# EAGLE design Maduino Zero Lorawan Node v2.0 (EAGLE 6.1)
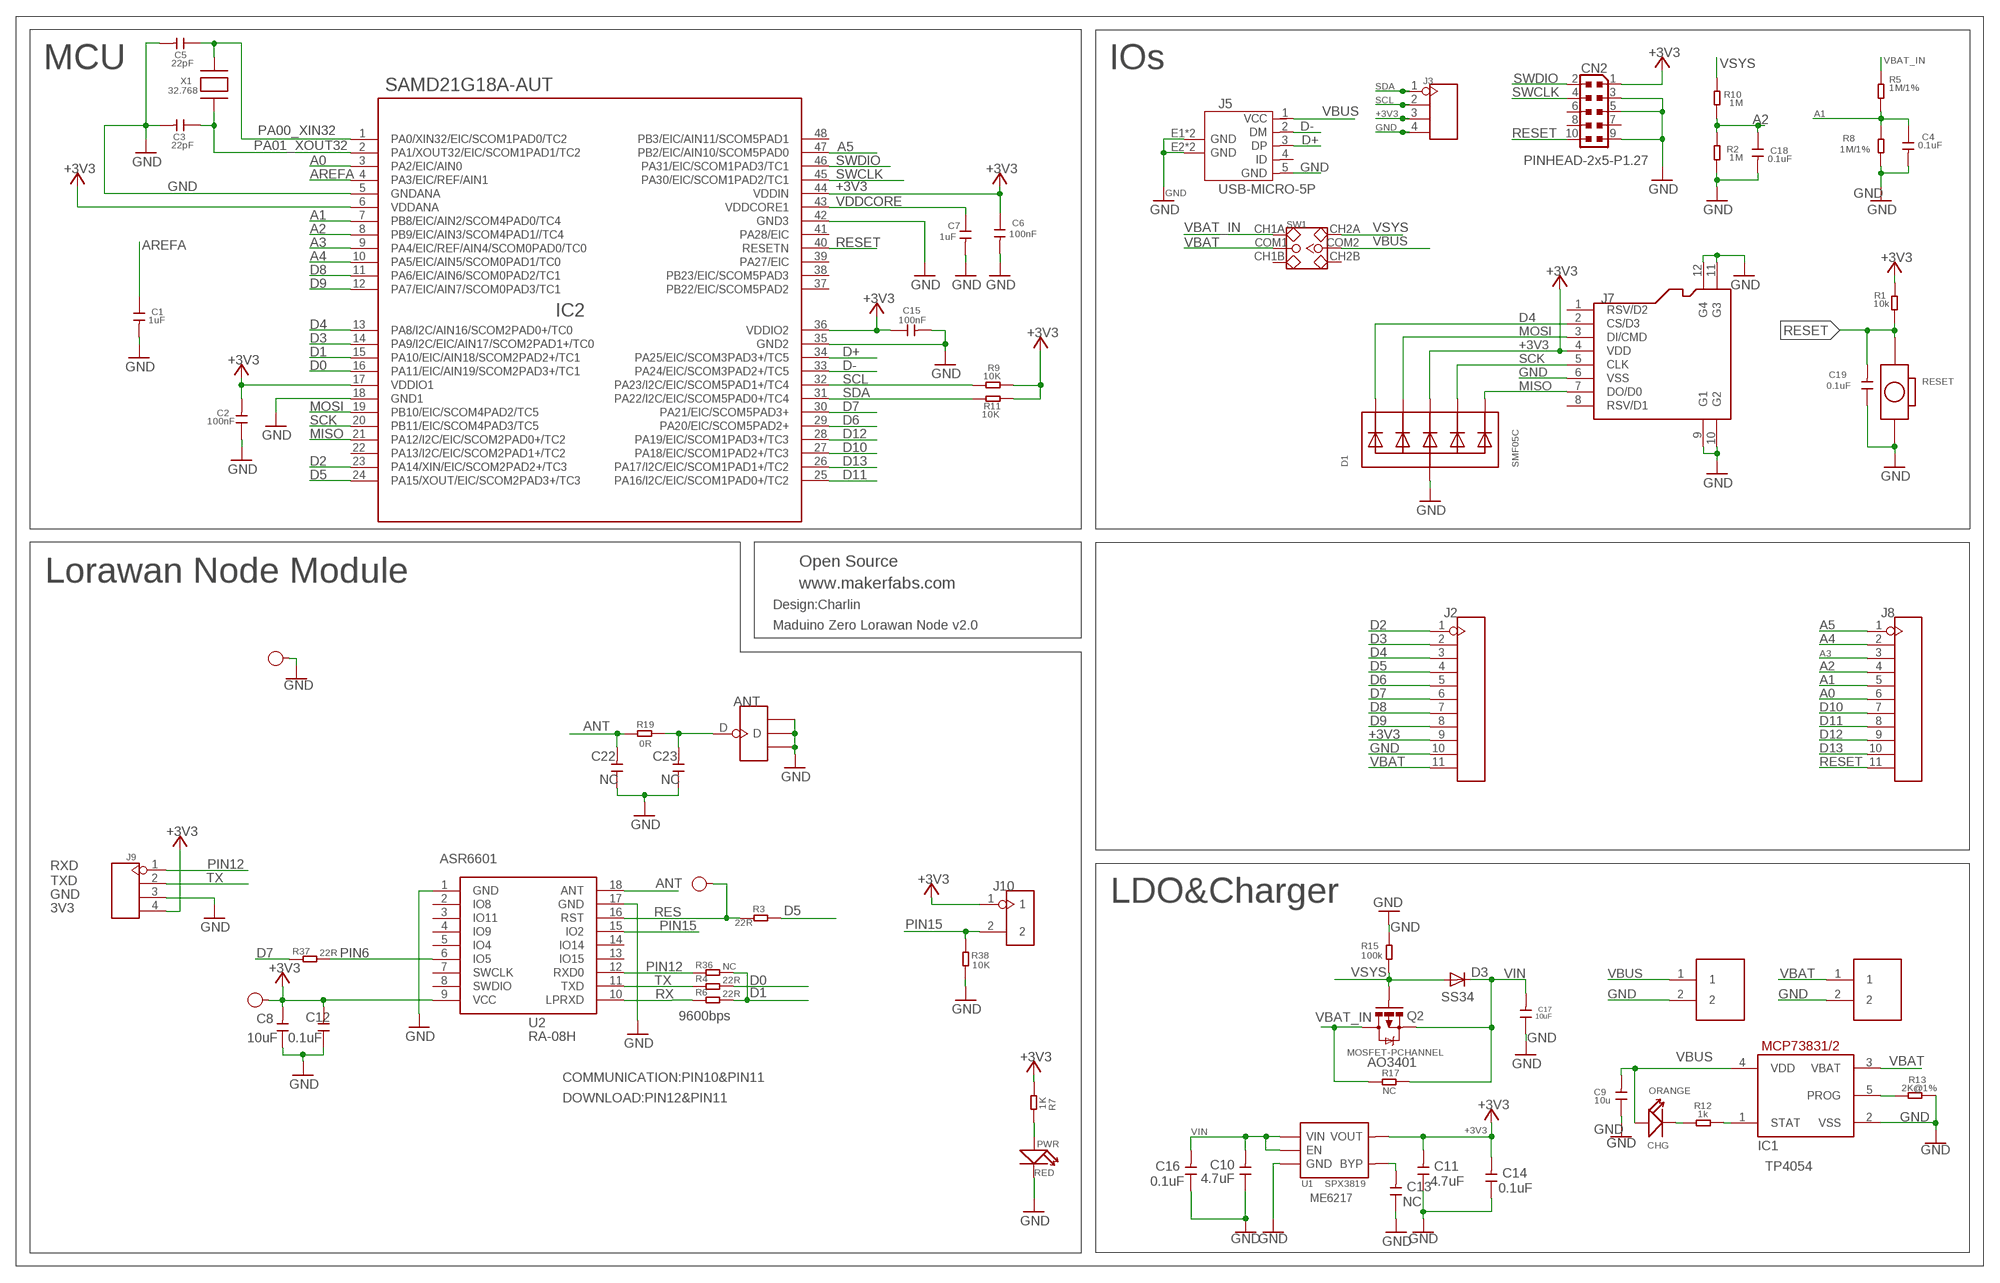
[diagram p0: schematic, sheet 1]

## Parts
3V3  TEST-POINT'4545'  [TP-D45MIL]
ANT  ANTENNA-U-FL  [4P-U-FL]
C1  1uF  C-0603  [0603]
C2  100nF  C-0603  [0603]
C3  22pF  C-0603  [0603]
C4  0.1uF  C-0603  [0603]
C5  22pF  C-0603  [0603]
C6  100nF  C-0603  [0603]
C7  1uF  C-0603  [0603]
C8  10uF  C-0603  [0603]
C9  10u  C-0603  [0603]
C10  4.7uF  C-0603  [0603]
C11  4.7uF  C-0603  [0603]
C12  0.1uF  C-0603  [0603]
C13  NC  C-0603  [0603]
C14  0.1uF  C-0603  [0603]
C15  100nF  C-0603  [0603]
C16  0.1uF  C-0603  [0603]
C17  10uF  C-0603  [0603]
C18  0.1uF  C-0603  [0603]
C19  0.1uF  C-0603  [0603]
C22  NC  C-0603  [0603]
C23  NC  C-0603  [0603]
CHG  ORANGE  007-LED0603  [D0603]
CN2  PINHEAD-2x5-P1.27  0171_PH127-205DF055G00AROUND-PADS  [PINHEAD_2X05_127]
D1  SMF05C  TVSARRAY_5LANE  [SOT363]
D3  SS34  DIODE-DO-214AC  [DO-214AC]
GND  TEST-POINT'4545'  [TP-D45MIL]
IC1  MCP73831/OT  [SOT23-5L]
IC2  SAMD21G18A-AUT  ATSAMD21G18A-AUT  [TQFP48-7X7]
J1  PH2.0-2P-90-DIP  [PH2.0-2P-90-DIP]
J2  HEADER-11P-2.54  [11P-2.54]
J3  HEADER-4P-60/35MILROUND  [4P-65/35ROUND]
J5  USB-MICRO-5P  [MICRO-USB-5P]
J6  PH2.0-2P-90-DIP  [PH2.0-2P-90-DIP]
J7  HOLDER-MICROSD-8P  [8P-SMD]
J8  HEADER-11P-2.54  [11P-2.54]
J9  HEADER-4P-60/35MILROUND  [4P-65/35ROUND]
J10  HEADER-2P-2.0  [2P-2.0]
PWR  RED  LED'0603'  [LED-0603]
Q2  MOSFET-PCHANNEL  [SOT23-3]
R1  10k  R-0603  [R0603]
R2  1M  R-0603  [R0603]
R3  22R  R-0603  [R0603]
R4  22R  R-0603  [R0603]
R5  1M/1%  R-0603  [R0603]
R6  22R  R-0603  [R0603]
R7  1K  R-0603  [R0603]
R8  1M/1%  R-0603  [R0603]
R9  10K  R-0603  [R0603]
R10  1M  R-0603  [R0603]
R11  10K  R-0603  [R0603]
R12  1k  R-0603  [R0603]
R13  2K@1%  R-0603  [R0603]
R15  100k  R-0603  [R0603]
R17  NC  R-0603  [R0603]
R19  0R  R-0603  [R0603]
R36  NC  R-0603  [R0603]
R37  22R  R-0603  [R0603]
R38  10K  R-0603  [R0603]
RESET  BOTTON-2P-90D  [2P-7.62X3.56-90D]
RST  TEST-POINT'4545'  [TP-D45MIL]
SW1  SWITCH-2CH-6P  [6P-2CH-2.54-7.6X3.0]
U1  SPX3819  [SOT23-5]
U2  RA-08H  [RA-08H]
X1  32.768  XTAL-3.2X1.5  [XTAL3215]

## Nets
+3V3: 3V3.T C2.2 C6.1 C8.2 C11.2 C12.2 C14.2 C15.1 CN2.1 D1.4(C3) IC2.6(VDDANA) IC2.17(VDDIO1) IC2.36(VDDIO2) IC2.44(VDDIN) J2.9 J3.3 J7.4(VDD) J9.4 J10.1 R1.2 R7.1 R9.2 R11.2 U1.5(VOUT) U2.9(VCC)
A0: IC2.3(PA2/EIC/AIN0) J8.6
A1: C4.1 IC2.7(PB8/EIC/AIN2/SCOM4PAD0/TC4) J8.5 R5.1 R8.2
A2: C18.1 IC2.8(PB9/EIC/AIN3/SCOM4PAD1//TC4) J8.4 R2.2 R10.1
A3: IC2.9(PA4/EIC/REF/AIN4/SCOM0PAD0/TC0) J8.3
A4: IC2.10(PA5/EIC/AIN5/SCOM0PAD1/TC0) J8.2
A5: IC2.47(PB2/EIC/AIN10/SCOM5PAD0) J8.1
ANT: C22.2 R19.1 U2.18(ANT)
AREFA: C1.1 IC2.4(PA3/EIC/REF/AIN1)
D0: IC2.16(PA11/EIC/AIN19/SCOM2PAD3+/TC1) R4.2
D1: IC2.15(PA10/EIC/AIN18/SCOM2PAD2+/TC1) R6.2 R36.2
D2: IC2.23(PA14/XIN/EIC/SCOM2PAD2+/TC3) J2.1
D3: IC2.14(PA9/I2C/EIC/AIN17/SCOM2PAD1+/TC0) J2.2
D4: D1.1(C1) IC2.13(PA8/I2C/AIN16/SCOM2PAD0+/TC0) J2.3 J7.2(CS/D3)
D5: IC2.24(PA15/XOUT/EIC/SCOM2PAD3+/TC3) J2.4 R3.2
D6: IC2.29(PA20/EIC/SCOM5PAD2+) J2.5
D7: IC2.30(PA21/EIC/SCOM5PAD3+) J2.6 R37.1
D8: IC2.11(PA6/EIC/AIN6/SCOM0PAD2/TC1) J2.7
D9: IC2.12(PA7/EIC/AIN7/SCOM0PAD3/TC1) J2.8
D10: IC2.27(PA18/EIC/SCOM1PAD2+/TC3) J8.7
D11: IC2.25(PA16/I2C/EIC/SCOM1PAD0+/TC2) J8.8
D12: IC2.28(PA19/EIC/SCOM1PAD3+/TC3) J8.9
D13: IC2.26(PA17/I2C/EIC/SCOM1PAD1+/TC2) J8.10
D+: IC2.34(PA25/EIC/SCOM3PAD3+/TC5) J5.3(DP)
D-: IC2.33(PA24/EIC/SCOM3PAD2+/TC5) J5.2(DM)
GND: ANT.GND1 ANT.GND2 ANT.GND3 C1.2 C2.1 C3.2 C4.2 C5.2 C6.2 C7.2 C8.1 C9.1 C10.1 C11.1 C12.1 C13.1 C14.1 C15.2 C16.1 C17.1 C18.2 C19.1 C22.1 C23.1 CN2.3 CN2.5 CN2.9 D1.2(A) GND.T IC1.2(VSS) IC2.5(GNDANA) IC2.18(GND1) IC2.35(GND2) IC2.42(GND3) J1.2 J2.10 J3.4 J5.5(GND) J5.E1(GND) J5.E2(GND) J5.P1(GND) J5.P2(GND) J6.2 J7.6(VSS) J7.9(G1) J7.10(G2) J7.11(G3) J7.12(G4) J9.3 PWR.- R2.1 R8.1 R13.2 R15.2 R38.2 RESET.P$2 U1.2(GND) U2.1(GND) U2.17(GND)
MISO: D1.6(C5) IC2.21(PA12/I2C/EIC/SCOM2PAD0+/TC2) J7.7(DO/D0)
MOSI: D1.3(C2) IC2.19(PB10/EIC/SCOM4PAD2/TC5) J7.3(DI/CMD)
N$3: PWR.+ R7.2
N$13: ANT.D C23.2 R19.2
N$25: CHG.- R12.1
N$26: IC1.1(STAT) R12.2
N$31: IC1.5(PROG) R13.1
N$76: C13.2 U1.4(BYP)
PA00_XIN32: C5.1 IC2.1(PA0/XIN32/EIC/SCOM1PAD0/TC2) X1.P$2
PA01_XOUT32: C3.1 IC2.2(PA1/XOUT32/EIC/SCOM1PAD1/TC2) X1.P$1
PIN6: R37.2 U2.6(IO5)
PIN12: J9.1 R36.1 U2.12(RXD0)
PIN15: J10.2 R38.1 U2.15(IO2)
RES: R3.1 RST.T U2.16(RST)
RESET: C19.2 CN2.10 IC2.40(RESETN) J8.11 R1.1 RESET.P$1
RX: R6.1 U2.10(LPRXD)
SCK: D1.5(C4) IC2.20(PB11/EIC/SCOM4PAD3/TC5) J7.5(CLK)
SCL: IC2.32(PA23/I2C/EIC/SCOM5PAD1+/TC4) J3.2 R9.1
SDA: IC2.31(PA22/I2C/EIC/SCOM5PAD0+/TC4) J3.1 R11.1
SWCLK: CN2.4 IC2.45(PA30/EIC/SCOM1PAD2/TC1)
SWDIO: CN2.2 IC2.46(PA31/EIC/SCOM1PAD3/TC1)
TX: J9.2 R4.1 U2.11(TXD)
VBAT: IC1.3(VBAT) J2.11 J6.1 SW1.COM1
VBAT_IN: Q2.3(D) R5.2 R17.1 SW1.CH1A
VBUS: C9.2 CHG.+ IC1.4(VDD) J1.1 J5.1(VCC) SW1.COM2
VDDCORE: C7.1 IC2.43(VDDCORE1)
VIN: C10.2 C16.2 C17.2 D3.C Q2.2(S) R17.2 U1.1(VIN) U1.3(EN)
VSYS: D3.A Q2.1(G) R10.2 R15.1 SW1.CH2A
Unconnected: CN2.6 CN2.7 CN2.8 IC2.22(PA13/I2C/EIC/SCOM2PAD1+/TC2) IC2.37(PB22/EIC/SCOM5PAD2) IC2.38(PB23/EIC/SCOM5PAD3) IC2.39(PA27/EIC) IC2.41(PA28/EIC) IC2.48(PB3/EIC/AIN11/SCOM5PAD1) J5.4(ID) J7.1(RSV/D2) J7.8(RSV/D1) SW1.CH1B SW1.CH2B U2.2(IO8) U2.3(IO11) U2.4(IO9) U2.5(IO4) U2.7(SWCLK) U2.8(SWDIO) U2.13(IO15) U2.14(IO14)

## Notes on the sheet
- MCU | IOs
- Open Source
- Lorawan Node Module
- www.makerfabs.com
- Design:Charlin
- Maduino Zero Lorawan Node v2.0
- ASR6601
- RXD
- TXD
- GND
- LDO&Charger
- 3V3
- 9600bps
- AO3401
- COMMUNICATION:PIN10&PIN11
- DOWNLOAD:PIN12&PIN11
- TP4054
- ME6217

## Library data of the parts
3V3 GND RST = Discrete-new:TEST-POINT; PARTNO: DNP
ANT = Connector:ANTENNA-U-FL
C1-C19 C22 C23 = Discrete:C*: Ceramic Capacitors
CHG = Discrete:007-LED*
CN2 = Connettori:0171_PH127-205DF055G00A: 2x5 PASSO 1,27
D1 = microbuilder:TVSARRAY_5LANE: Voltage Transient Suppressor Array SOT363 SMF05C - 100W 5V: Digikey - SMF05CT1GOSCT-ND
D3 = diode:DIODE-: DIODE
IC1 = adafruit:MCP73831: MCP73831/2 Miniature Single-Cell, Fully Integrated Li-Ion, Li-Polymer Charge Management Controllers. Nice and small simple lipoly charge controller, with adjustable current and status output (LED) http://www.ladyada.net/library/pcb/eaglelibrary.html
IC2 = IC:ATSAMD21G18A-AUT: Atmel D21 32bit ARM Cortex-M0 microcontroller - 48 PIN TQFP 256KB flash memory + 32KB SRAM
J1 J6 = Connector:PH2.0-2P-90-DIP
J2 J8 = Connector:HEADER-11P
J3 J9 = Connector:HEADER-4P
J5 = Connector:USB-MICRO-5P
J7 = Connector:HOLDER-MICROSD-8P
J10 = Connector:HEADER-2P
PWR = Discrete:LED*
Q2 = User-Submitted:MOSFET-PCHANNEL: Generic PMOSFET IRLML2244 - TRANS-11153 (SOT-23 -20V -4.3A) (1.Gate 2.Source 3.Drain) FQP27P06 - COM-10349 <http://www.sparkfun.com/products/10349> (TO-220 -60V -27A) (1.Gate 2.Source 3.Drain); PROD_ID: TRANS-08285
R1-R13 R15 R17 R19 R36-R38 = Discrete:R*
RESET = Discrete:BOTTON-2P
SW1 = Discrete:SWITCH-2CH-6P
U1 = IC:SPX3819
U2 = sale:RA-08H
X1 = adafruit2:XTAL: Low cost SMT crystals, no capacitors included http://www.ladyada.net/library/eagle

## Net classes
0 default: width 0.152 mm, drill 0.305 mm, clearance 0.152 mm
2 gnd: width 0.305 mm, drill 0.559 mm, clearance 0.254 mm
3 usbvcc: width 0.508 mm, drill 0.61 mm, clearance 0.254 mm
4 USBpair: width 0.254 mm, drill 0.406 mm, clearance 0.406 mm

## Board
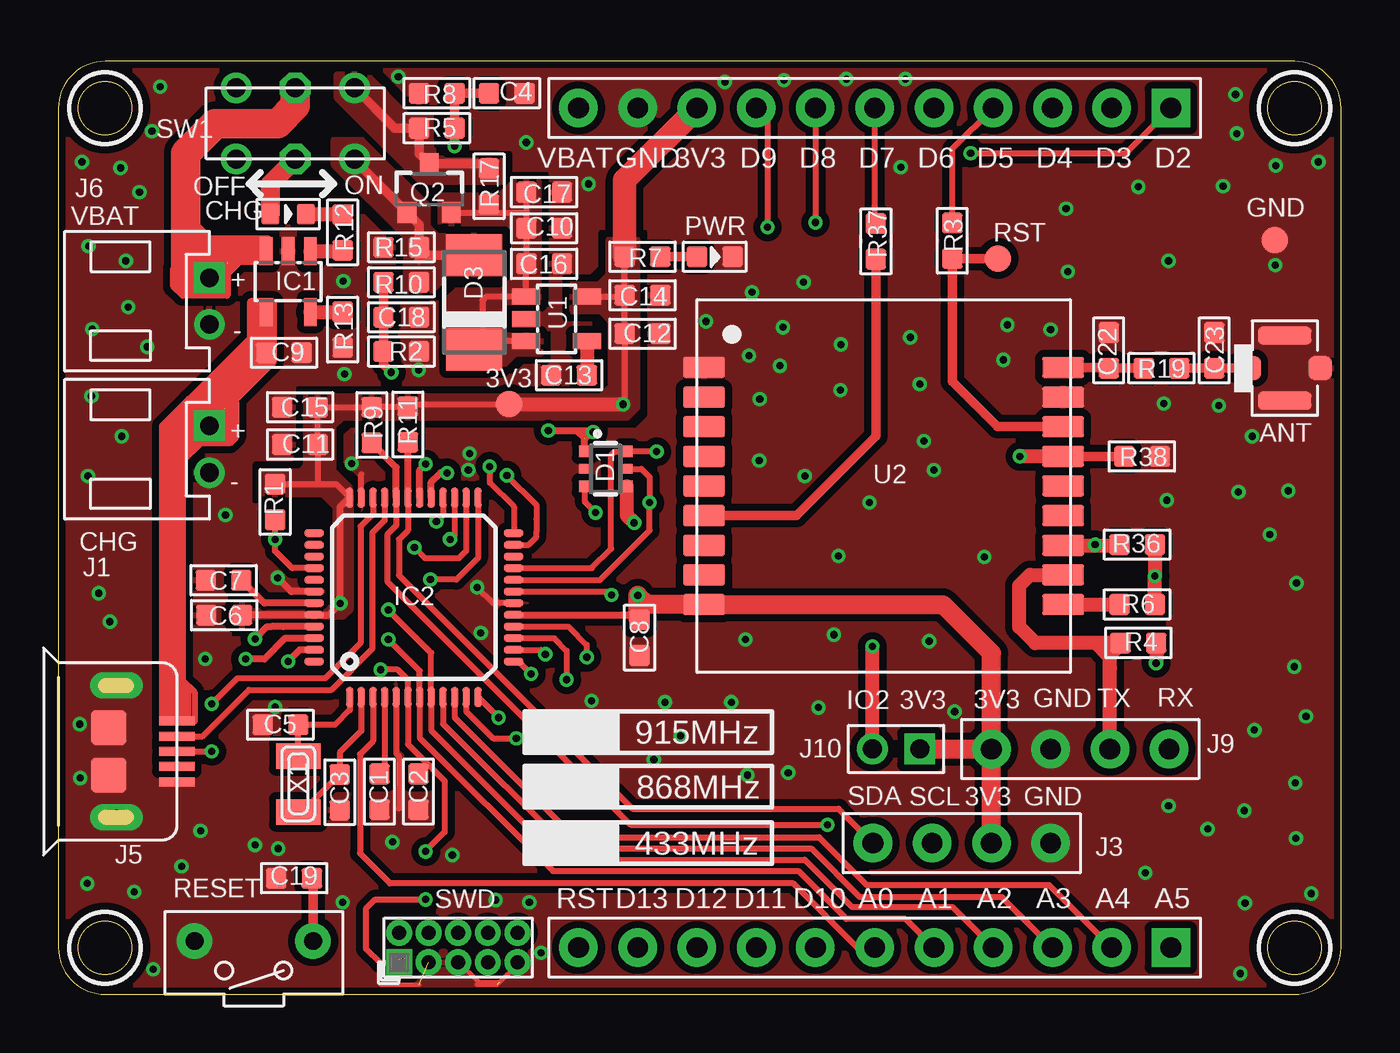
[diagram p1: board, top side]
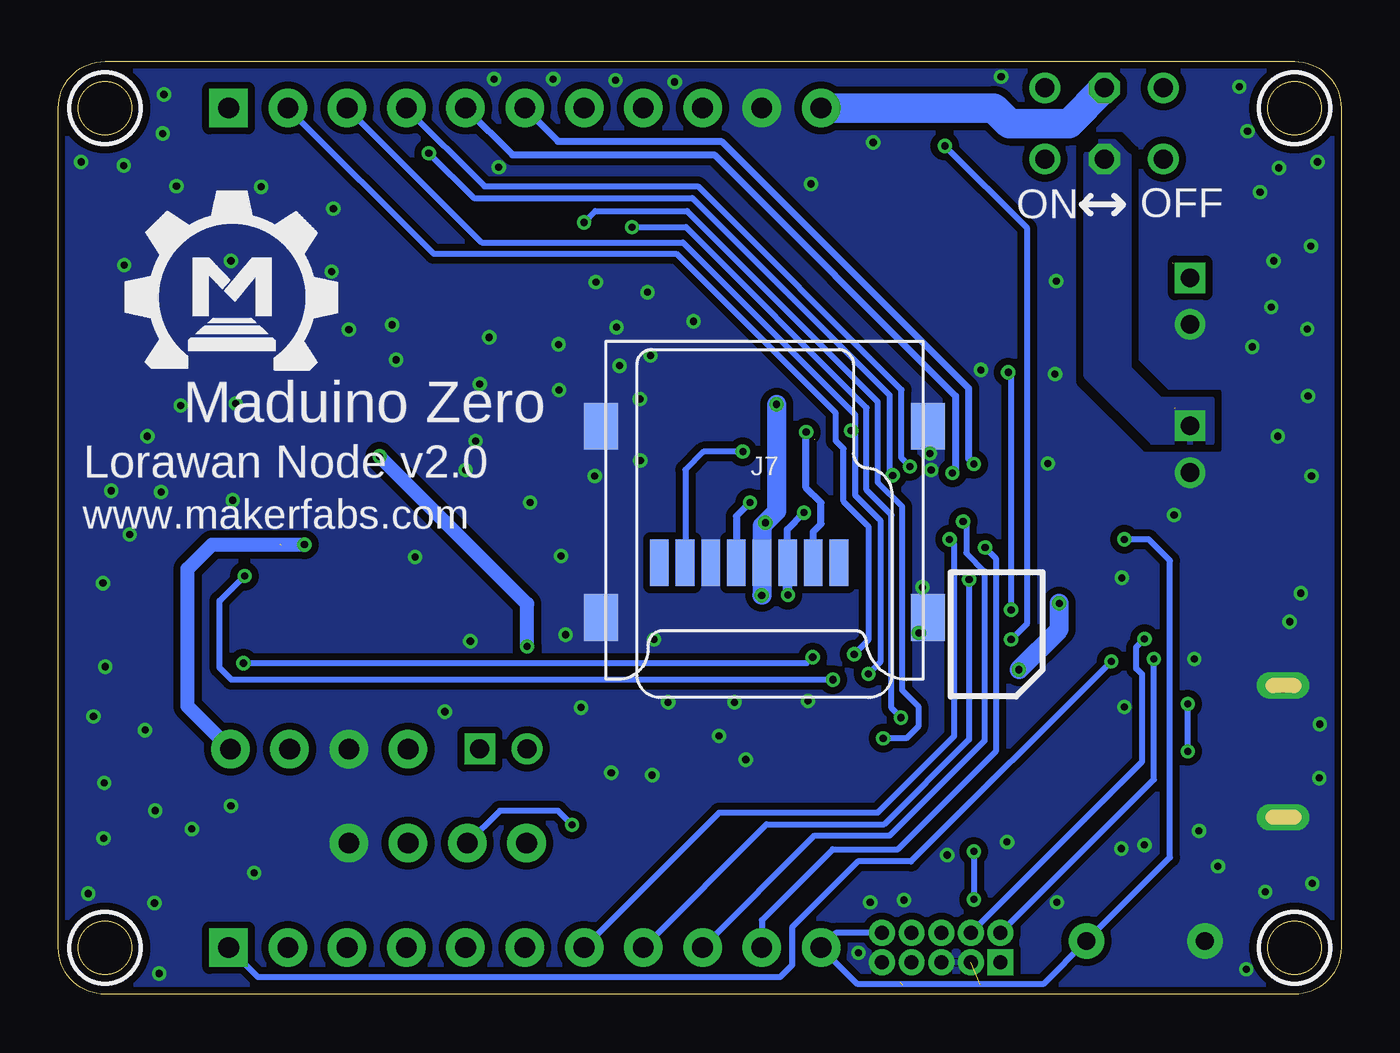
[diagram p2: board, bottom side, seen from below]

Size 55 x 40 mm. Coordinates in mm from the lower left corner, seen from the top.
Outline: 0,38 0,2 arc90 2,0 53,0 arc90 55,2 55,38 arc90 53,40 2,40 arc90 0,38
Outline: circle at 53,2 radius 1.14
Outline: circle at 53,38 radius 1.14
Outline: circle at 2,2 radius 1.14
Outline: circle at 2,38 radius 1.14
Copper layers (1*16): Top 0.035mm / dielectric 1.5mm / Bottom 0.035mm
Design rules: minimum track width 6mil, minimum drill 10mil, track to track 6mil, track to pad 6mil, pad to pad 6mil, via to via 6mil, smd to smd 0mil, copper to edge 10mil, drill to drill 10mil, minimum pad ring 10mil, minimum via ring 6mil, stop-mask expansion 2mil, vias tented up to drill 30mil, thermal gap 0mil
tRestrict: area 51.5,0.5 to 54.5,3.5; area 51.5,36.5 to 54.5,39.5; area 0.5,0.5 to 3.5,3.5; area 0.5,36.5 to 3.5,39.5
bRestrict: area 51.5,0.5 to 54.5,3.5; area 51.5,36.5 to 54.5,39.5; area 0.5,0.5 to 3.5,3.5; area 0.5,36.5 to 3.5,39.5

### Footprints (pad centres in the part's own frame; a part is rotated, then mirrored left to right if it is on the bottom)
TP-D45MIL = smd 1.143 x 1.143: T 0,0
4P-U-FL = smd 1.016 x 1.016: D -1.524,0; GND3 1.524,0 | smd 2.286 x 0.762: GND1 0,1.397; GND2 0,-1.397
0603 = smd 0.889 x 0.889: 1 -0.762,0; 2 0.762,0
D0603 = smd 0.762 x 0.889: + -0.762,0; - 0.762,0
PINHEAD_2X05_127 = drill 0.6 pad 1.016 square: 1 -0.635,2.54 | drill 0.6 pad 1.016: 2 0.635,2.54; 3 -0.635,1.27; 4 0.635,1.27; 5 -0.635,0; 6 0.635,0; 7 -0.635,-1.27; 8 0.635,-1.27; 9 -0.635,-2.54; 10 0.635,-2.54
SOT363 = smd 0.5 x 0.5: 1 -0.75,-0.9; 3 0.75,-0.9; 4 0.75,0.9; 6 -0.75,0.9 | smd 0.4 x 0.5: 2 0,-0.9; 5 0,0.9
DO-214AC = smd 1.8 x 2.4: A 2.025,0; C -2.025,0
SOT23-5L = smd 0.55 x 1.2: 1 -0.95,-1.3; 2 0,-1.3; 3 0.95,-1.3; 4 0.95,1.3; 5 -0.95,1.3
TQFP48-7X7 = smd 0.85 x 0.32: 1 -4.275,2.75; 2 -4.275,2.25; 3 -4.275,1.75; 4 -4.275,1.25; 5 -4.275,0.75; 6 -4.275,0.25; 7 -4.275,-0.25; 8 -4.275,-0.75; 9 -4.275,-1.25; 10 -4.275,-1.75; 11 -4.275,-2.25; 12 -4.275,-2.75; 25 4.275,-2.75; 26 4.275,-2.25; 27 4.275,-1.75; 28 4.275,-1.25; 29 4.275,-0.75; 30 4.275,-0.25; 31 4.275,0.25; 32 4.275,0.75; 33 4.275,1.25; 34 4.275,1.75; 35 4.275,2.25; 36 4.275,2.75 | smd 0.32 x 0.85: 13 -2.75,-4.275; 14 -2.25,-4.275; 15 -1.75,-4.275; 16 -1.25,-4.275; 17 -0.75,-4.275; 18 -0.25,-4.275; 19 0.25,-4.275; 20 0.75,-4.275; 21 1.25,-4.275; 22 1.75,-4.275; 23 2.25,-4.275; 24 2.75,-4.275; 37 2.75,4.275; 38 2.25,4.275; 39 1.75,4.275; 40 1.25,4.275; 41 0.75,4.275; 42 0.25,4.275; 43 -0.25,4.275; 44 -0.75,4.275; 45 -1.25,4.275; 46 -1.75,4.275; 47 -2.25,4.275; 48 -2.75,4.275
PH2.0-2P-90-DIP = drill 0.8 square: 1 0,1 | drill 0.8: 2 0,-1
11P-2.54 = drill 0.889 pad 1.651 square: 1 0,12.7 | drill 0.889 pad 1.651: 2 0,10.16; 3 0,7.62; 4 0,5.08; 5 0,2.54; 6 0,0; 7 0,-2.54; 8 0,-5.08; 9 0,-7.62; 10 0,-10.16; 11 0,-12.7
4P-65/35ROUND = drill 0.889 pad 1.651: 1 0,3.81; 2 0,1.27; 3 0,-1.27; 4 0,-3.81
MICRO-USB-5P = smd 0.38 x 1.52: 1 -1.3,0; 2 -0.65,0; 3 0,0; 4 0.65,0; 5 1.3,0 | smd 1.524 x 1.524: E1 -1.016,-2.921; E2 1.016,-2.921 | drill 0.635 pad 1.143 long: P1 -2.819,-2.591; P2 2.819,-2.591
8P-SMD = smd 0.8 x 2.008: 1 -3.198,0.254; 2 -2.098,0.254; 3 -0.998,0.254; 4 0.102,0.254; 5 1.202,0.254; 6 2.302,0.254; 7 3.402,0.254; 8 4.502,0.254 | smd 1.45 x 2: 9 -7.002,2.6; 10 7.002,2.6; 11 -7.002,-5.598; 12 7.002,-5.598
2P-2.0 = drill 0.813 pad 1.27 square: 1 -1.016,0 | drill 0.813 pad 1.27: 2 1.016,0
LED-0603 = smd 0.889 x 0.889: + -0.762,0; - 0.762,0
SOT23-3 = smd 0.8 x 0.9: 1 -0.95,-1; 2 0.95,-1; 3 0,1.1
R0603 = smd 0.889 x 0.889: 1 -0.762,0; 2 0.762,0
2P-7.62X3.56-90D = drill 0.762 pad 1.524: P$1 0,2.54; P$2 0,-2.54
6P-2CH-2.54-7.6X3.0 = drill 0.813 pad 1.27: CH1A -1.524,2.54; CH1B -1.524,-2.54; CH2A 1.524,2.54; CH2B 1.524,-2.54 | drill 0.813 pad 1.27 octagon: COM1 -1.524,0; COM2 1.524,0
SOT23-5 = smd 0.69 x 1.2: 1 -0.95,-1.3; 2 0,-1.3; 3 0.95,-1.3; 4 0.95,1.3; 5 -0.95,1.3
RA-08H = smd 1.8 x 0.91: 1 -7.7,5.08; 2 -7.7,3.81; 3 -7.7,2.54; 4 -7.7,1.27; 5 -7.7,0; 6 -7.7,-1.27; 7 -7.7,-2.54; 8 -7.7,-3.81; 9 -7.7,-5.08; 10 7.7,-5.08; 11 7.7,-3.81; 12 7.7,-2.54; 13 7.7,-1.27; 14 7.7,0; 15 7.7,1.27; 16 7.7,2.54; 17 7.7,3.81; 18 7.7,5.08
XTAL3215 = smd 1.1 x 1.9: P$1 1.2,0; P$2 -1.2,0

### Placement (x,y rotation side)
3V3  19.33,25.3 0 top
ANT  52.58,26.85 0 top
C1  13.77,8.69 270 top
C2  15.44,8.69 90 top
C3  12.06,8.66 270 top
C4  19.23,38.63 0 top
C5  9.53,11.56 180 top
C6  7.11,16.26 180 top
C7  7.09,17.75 180 top
C8  24.92,15.29 90 top
C9  9.68,27.51 180 top
C10  20.83,32.84 180 top
C11  10.36,23.57 0 top
C12  25.04,28.32 180 top
C13  21.89,26.54 0 top
C14  25.04,29.97 180 top
C15  10.36,25.17 180 top
C16  20.83,31.32 180 top
C17  20.83,34.39 180 top
C18  14.71,29.03 0 top
C19  10.11,4.98 0 top
C22  45.03,27.61 270 top
C23  49.56,27.61 270 top
CHG  9.86,33.45 0 top
CN2  17.14,2 90 top
D1  23.47,22.53 270 top
D3  17.83,29.67 90 top
GND  52.15,32.33 0 top
IC1  9.86,30.56 180 top
IC2  15.24,17.02 90 top
J1  6.48,23.37 0 top
J2  35,38 270 top
J3  38.73,6.48 90 top
J5  5.08,10.41 270 top
J6  6.48,29.72 0 top
J7  24.73,18.76 180 bottom
J8  35,2 270 top
J9  43.81,10.52 270 top
J10  35.92,10.52 180 top
PWR  28.14,31.62 0 top
Q2  15.9,34.52 0 top
R1  9.3,21.11 90 top
R2  14.71,27.56 180 top
R3  38.33,32.31 90 top
R4  46.3,15.06 0 top
R5  16.23,37.13 180 top
R6  46.25,16.71 0 top
R7  25.04,31.62 0 top
R8  16.23,38.63 0 top
R9  13.44,24.41 90 top
R10  14.71,30.53 0 top
R11  14.99,24.43 90 top
R12  12.19,32.66 270 top
R13  12.19,28.5 270 top
R15  14.71,32.03 180 top
R17  18.47,34.65 270 top
R19  47.29,26.85 0 top
R36  46.25,19.28 0 top
R37  35.05,32.28 270 top
R38  46.46,23.06 0 top
RESET  8.38,2.29 270 top
RST  40.28,31.55 180 top
SW1  10.16,37.34 270 top
U1  21.36,28.96 270 top
U2  35.38,21.79 0 top
U$1  [MAKERFABS_0.3]  51.67,26.82 0 bottom
X1  10.29,9.02 270 top

### Tracks (layer width: path | path; a pad name or v marks a point on that pad's centre or on a via)
+3V3  (via drill 0.3)
  Top 0.254: CN2.1 14.59,1.35 13.79,1.35 13.18,1.96 13.18,3.66 13.59,4.06 v15.75,4.06 | v15.75,6.12 15.75,6.15 16.56,6.96 16.56,9.14 15.85,9.86 | v13.82,13.92 14.55,13.92 14.99,13.48 IC2.6 14.99,10.71 15.85,9.86 | C2.2 15.85,9.86 | 3V3.T 15.09,25.3 R11.2 13.46,25.2 R9.2 C15.1 C11.2 11.12,21.89 11.15,21.87 | v24.21,25.3 24.28,25.38 C12.2 C14.2 | C14.2 R7.1 | U1.5 24.22,29.91 C14.2 | R1.2 11.15,21.87 | 11.15,21.87 11.91,21.87 IC2.36
  Top 0.305: IC2.17 24.79,16.27 | C6.1 IC2.44 11.59,16.27 v12.09,16.76 12.09,20.89 IC2.36
  Top 0.61: D1.4 24.37,20.54 v24.69,20.22 | 3V3.T v24.21,25.3
  Top 0.813: J3.3 J9.4 | J9.4 40.01,14.63 37.92,16.71 U2.9 25.23,16.71 v24.84,17.11 24.84,16.22 | J10.1 J9.4 | C8.2 24.84,16.13 24.84,16.22 | 24.84,16.22 24.79,16.27
  Top 1.016: R7.1 24.28,34.9 J2.9
  Bottom 0.254: 24.82,18.52 J7.4 | v15.75,6.12 v15.75,4.06
  Bottom 0.61: 24.82,20.09 v24.69,20.22
  Bottom 0.813: 24.82,18.52 24.82,20.09 | v24.21,25.3 24.21,20.7 v24.69,20.22 | v13.82,13.92 12.09,15.65 v12.09,16.76 | J7.4 v24.83,17.12 v24.84,17.11
  pour Top: 24.82,32.36 24.82,25.15 24.38,24.71 12.17,24.71 11.79,24.33 11.79,22.45 12.52,21.72 12.52,16.48 12.22,16.18 8.46,16.18 8.05,15.77 7.44,15.77 7.44,16.66 8.13,16.66 8.36,16.43 11.53,16.43 11.89,16.79 11.89,20.88 11.33,21.44 8.76,21.44 8.76,22.43 10.39,22.43 10.54,22.58 10.62,22.66 10.62,25.65 23.27,25.65 23.7,26.09 23.7,28.8 23.24,29.26 22.05,29.26 22.05,30.3 22.05,30.45 23.19,30.45 23.6,30.86 23.6,32.31 23.6,32.36
A0
  Top 0.254: J8.6 34.27,2 31.52,4.75 14.22,4.75 12.93,6.04 12.93,10.29 13.49,10.85 IC2.3
A1  (via drill 0.3)
  Top 0.254: J8.5 36.31,3.23 33.78,3.23 31.73,5.28 21.21,5.28 15.49,11 IC2.7 15.49,13.87 v14.15,15.21
  Top 0.406: C4.1 R8.2 R5.1 v16.99,36.37
  Bottom 0.254: v14.15,15.21 13.46,15.9 13.46,32.84 v16.99,36.37
A2  (via drill 0.3)
  Top 0.254: J8.4 38.35,3.73 34.04,3.73 32,5.77 21.54,5.77 15.99,11.31 IC2.8 15.99,14.64 v14.15,16.48
  Top 0.406: R10.1 C18.1 R2.2 13.95,27 v14.28,26.67
  Bottom 0.254: v14.15,16.48 14.15,26.54 v14.28,26.67
A3
  Top 0.254: J8.3 40.45,4.17 34.37,4.17 32.28,6.25 23.16,6.25 22.17,6.25 21.84,6.25 16.49,11.6 IC2.9
A4
  Top 0.254: J8.2 42.49,4.67 34.67,4.67 32.61,6.73 23.5,6.73 22.45,6.73 22.12,6.73 16.99,11.86 IC2.10
A5  (via drill 0.3)
  Top 0.254: IC2.47 10.78,14.77
  Top 0.305: 10.78,14.77 10.35,14.77 v9.86,14.28
  Bottom 0.254: J8.1 46.44,0.74 24.05,0.74 23.55,1.25 23.55,2.87 20.73,5.69 18.44,5.69 v9.86,14.28
ANT
  Top 0.406: R19.1 C22.2 45.01,26.87 U2.18
AREFA
  Top 0.254: IC2.4 13.99,9.67 C1.1
D0  (via drill 0.3)
  Top 0.254: IC2.16 21.88,15.77 22.66,14.99 v22.66,14.45
  Top 0.61: R4.2 v47.07,14.2
  Bottom 0.254: v47.07,14.2 22.91,14.2 v22.66,14.45
D1  (via drill 0.3)
  Top 0.254: IC2.15 21.26,15.27 21.79,14.73 v21.79,13.49
  Top 0.61: R6.2 v47.02,17.93 R36.2
  Bottom 0.254: v21.79,13.49 47.57,13.49 48.08,13.99 48.08,16.87 v47.02,17.93
D2  (via drill 0.3)
  Top 0.254: v39.12,36.07 45.77,36.07 J2.1 | v19.23,22.25 20.5,20.98 20.5,20.37 20.5,19.81 20.5,19.61 20.16,19.27 IC2.23
  Bottom 0.254: v39.12,36.07 37.19,34.14 27.81,34.14 19.36,25.68 19.36,22.38 v19.23,22.25
D3  (via drill 0.3)
  Top 0.254: IC2.14 20.69,14.77 v20.88,14.58
  Bottom 0.254: J2.2 38.91,31.75 28.5,31.75 21.67,24.92 21.67,23.72 21.34,23.39 21.34,21.13 20.27,20.07 20.27,15.19 v20.88,14.58
D4  (via drill 0.3)  (1 unrouted)
  Top 0.254: 22.58,23.8 22.91,24.13 | 22.55,23.8 22.55,23.82 22.23,24.16 | IC2.13 19.74,14.27 v20.27,13.74
  Top 0.305: D1.1 22.57,24.03 22.43,24.17 | v21.01,24.17 22.43,24.17 | 22.43,24.17 22.87,24.17 22.91,24.13 v22.94,24.11
  Bottom 0.254: J2.3 36.85,32.23 28.22,32.23 20.83,24.84 20.83,24.21 | 20.83,24.21 20.83,21.39 19.76,20.32 19.76,14.25 v20.27,13.74 | v21.01,24.17 20.87,24.17 20.83,24.21
  Bottom 0.305: J7.2 22.63,19.84 22.3,20.17 22.3,21.08 22.94,21.72 v22.94,24.11
D5  (via drill 0.3)
  Top 0.254: v18.49,22.63 v18.5,22.62 18.5,21.94 19.53,20.9 19.53,19.79 IC2.24 | R3.2 38.33,36.25 J2.4
  Bottom 0.254: J2.4 36.73,34.65 27.58,34.65 18.85,25.91 18.85,22.99 v18.49,22.63
D6  (via drill 0.3)
  Top 0.305: IC2.29 15.99,21.96 16.38,22.35 v16.66,22.35
  Bottom 0.305: J2.5 35.53,35.99 26.87,35.99 16.54,25.65 16.54,22.48 v16.66,22.35
D7  (via drill 0.3)
  Top 0.254: R37.1 35,33.1 J2.6
  Top 0.305: IC2.30 15.49,22.48 v15.75,22.73
  Bottom 0.305: J2.6 33.58,36.58 26.57,36.58 15.98,25.98 15.98,22.96 v15.75,22.73
D8  (via drill 0.3)
  Top 0.254: J2.7 v32.46,33.1 | IC2.11 17.49,12.13 18.64,10.97 v19.63,10.97
  Bottom 0.254: v32.46,33.1 31.98,33.58 28.04,33.58 19.86,25.4 19.86,21.95 18.82,20.9 18.82,13.03 18.14,12.34 18.14,11.48 18.64,10.97 v19.63,10.97
D9  (via drill 0.3)
  Top 0.254: J2.8 30.4,37.52 v30.4,32.89 | IC2.12 v18.87,11.86
  Bottom 0.254: v30.4,32.89 28.09,32.89 20.34,25.15 20.34,21.61 19.28,20.55 19.28,12.27 v18.87,11.86
D10  (via drill 0.3)
  Top 0.254: IC2.27 16.99,19.71 v16.79,19.51
  Bottom 0.254: J8.7 26.66,7.8 19.86,7.8 16.59,11.07 16.59,19.3 v16.79,19.51
D11  (via drill 0.3)
  Top 0.254: IC2.25 17.99,18.7 17.07,17.78 v15.95,17.78
  Bottom 0.254: J8.8 24.63,7.29 19.58,7.29 15.95,10.92 v15.95,17.78
D12  (via drill 0.3)
  Top 0.254: 16.44,20.5 v16.2,20.27 16.49,20.55 IC2.28
  Bottom 0.254: J8.9 22.57,6.81 19.36,6.81 15.29,10.87 15.29,18.14 16.08,18.92 16.08,20.14 v16.2,20.27
D13  (via drill 0.3)
  Top 0.254: IC2.26 17.49,19.01 17.17,18.69 15.72,18.69 v15.27,19.15
  Bottom 0.254: J8.10 24.84,3.17 21.79,6.22 19,6.22 14.81,10.41 14.81,18.69 v15.27,19.15
D+  (via drill 0.3)
  Top 0.254: J5.3 v6.58,10.41 | v6.58,12.45 7.7,13.56 11.46,13.56 12.95,15.06 12.95,20.07 13.49,20.6 IC2.34
  Bottom 0.254: v6.58,10.41 v6.58,12.45
D-
  Top 0.254: J5.2 6.19,11.06 8.18,13.06 11.71,13.06 13.46,14.81 13.46,19.79 13.99,20.32 IC2.33
GND  (via drill 0.3)  (2 unrouted)
  Top 0.203: 19.75,1.33 19.81,1.4 | CN2.9 19.72,1.36 19.75,1.33 | 19.75,1.33 18.92,0.51 18.03,0.51 17.14,1.4 | 18.82,0.41 17.93,0.41 | 15.47,0.41 13.82,0.41
  Top 0.254: IC2.5 14.49,10.33 14.61,10.21 14.61,7.95 | IC2.35 12.99,22.29 | IC2.18 18.64,16.77 v17.96,17.45
  Top 0.305: IC2.42 9.99,17.27 v9.4,17.86
  other vias: 22.73,34.75 2.72,23.93 3.81,27.76 0.94,9.27 0.91,11.58 1.45,28.52 50.88,3.91 12.27,26.59 53.49,11.91 7.16,20.55 3,29.46 1.27,22.23 3.48,34.39 14.58,39.34 4.37,38.91 1.42,25.65 12.22,30.58 12.57,22.76 9.42,6.25 50.6,21.54 14.33,6.53 6.3,14.38 20.7,1.78 8.43,6.4 1.24,4.75 3.25,4.39 6.1,7.01 4.06,1.07 16.89,5.97 42.55,28.5 18.11,15.49 50.85,7.87 26.01,12.52 31.29,9.5 49.28,7.09 53.72,4.32 20.19,3.94 18.75,4.04 46.61,5.21 2.21,15.98 1.73,17.2 28.57,39.12 36.12,35.46 33.78,39.24 36.32,39.24 34.77,21.08 52.98,14.05 17.63,23.19 12.19,3.94 43.28,30.99 40.51,27.2 40.69,28.7 47.6,8.08 32.59,12.29 30.07,25.53 22.86,12.57 52.17,31.27 39.7,18.75 25.53,10.06 26.67,11.07 33.53,25.91 37.54,22.48 36.53,28.17 27.76,28.85 36.93,26.16 53.04,9.07 47.4,25.32 50.52,36.91 49.94,34.65 50.47,38.58 54.03,35.69 50.67,0.89 2.9,31.45 37.11,23.72 30.94,26.95 29.74,30.1 20.07,36.53 4.01,37.01 17.58,22.48 1.02,35.69 2.67,35.43 1.3,32.08 31.11,39.19 47.52,21.18 15.44,26.77 51.94,19.71 32,22.23 51.28,11.33 52.2,35.53 46.3,34.62 49.76,25.25 31.95,30.53 31.06,28.6 33.55,27.86 33.45,18.8 43.21,33.68 5.28,5.49 9.3,12.32 47.6,31.45 51.18,23.93 52.73,21.59 53.09,17.63 29.62,27.38 33.25,15.42 37.34,15.14 53.06,6.68 38.43,12.12 29.54,9.4 28.85,12.52 29.46,15.21 30.05,22.89
  pour Bottom (isolate 0.305, rank 6): -1.27,-1.27 60,-1.27 60,45 -1.27,45
  pour Top (isolate 0.305, rank 6): -1.27,-1.27 60,-1.27 60,45 -1.27,45
MISO  (via drill 0.3)
  Top 0.254: v25.65,23.27 24.38,23.27 D1.6 24.36,23.27 23.85,23.27 23.7,23.11 23.7,19.1 22.86,18.27 IC2.21
  Bottom 0.254: J7.7 28.12,18.52 28.12,22.48 27.33,23.27 v25.65,23.27
MOSI  (via drill 0.3)
  Top 0.254: D1.3 22.57,21.12 v23.04,20.65 | IC2.19 23.57,17.27 v23.72,17.12
  Bottom 0.203: 23.75,18.54 23.75,18.52 J7.3
  Bottom 0.254: J7.3
  Bottom 0.305: 23.75,18.54 23.75,19.94 v23.04,20.65
  Bottom 0.406: J7.3 v23.73,17.12 v23.72,17.12
N$3
  Top 0.406: R7.2 PWR.+
N$13
  Top 0.406: R19.2 C23.2 ANT.D
N$25
  Top 0.61: CHG.- 12.17,33.45 R12.1
N$26
  Top 0.61: IC1.1 12.15,31.86 R12.2
N$31
  Top 0.61: IC1.5 R13.1
N$76
  Top 0.61: U1.4 C13.2
PA00_XIN32
  Top 0.254: IC2.1 12.49,12.19 11.86,11.56 C5.1 X1.P$2
PA01_XOUT32
  Top 0.254: IC2.2 12.99,11.29 12.06,10.36 C3.1 10.46,7.82 X1.P$1
PIN6
  Top 0.406: U2.6 31.65,20.52 35.05,23.93 R37.2
PIN12  (via drill 0.3)  (1 unrouted)
  Top 0.254: 45.41,19.25 45.39,19.28 v44.45,19.28
  Top 0.61: U2.12 45.41,19.25
  Bottom 0.61: J9.1 49.45,12.34 49.45,18.24 48.41,19.28 v44.45,19.28
PIN15  (via drill 0.3)
  Top 0.406: U2.15 R38.1
  Top 0.61: J10.2 v34.9,14.91 | U2.15 v41.22,23.06
  Bottom 0.61: v34.9,14.91 34.9,16.74 v41.22,23.06
RES
  Top 0.406: U2.16 40.26,24.33 38.33,26.26 R3.1 RST.T
RESET  (via drill 0.3)
  Top 0.254: IC2.40 10.03,18.27 9.3,19 v9.3,19.51 R1.1
  Top 0.406: C19.2 10.92,4.93 RESET.P$1
  Bottom 0.254: CN2.10 21.66,2.63 J8.11 20.73,0.43 12.78,0.43 RESET.P$1 7.34,5.87 7.34,18.59 8.26,19.51 v9.3,19.51
RX
  Top 0.61: U2.10 R6.1
SCK  (via drill 0.3)
  Top 0.254: D1.5 24.99,22.53 25.35,22.17 v25.35,21.08 25.35,19.89 23.23,17.77 IC2.20
  Bottom 0.305: v25.35,21.08 25.93,20.5 J7.5
SCL  (via drill 0.3)
  Top 0.254: v32.97,7.26 24.54,7.26 14.1,17.7 14.1,19.71 14.49,20.1 IC2.32
  Top 0.305: IC2.32 14.49,22.59 R9.1
  Bottom 0.254: J3.2 36.07,7.87 33.58,7.87 v32.97,7.26
SDA
  Top 0.254: J3.1 33.45,7.95 24.61,7.95 14.61,17.96 14.61,19.51 14.99,19.89 IC2.31
  Top 0.305: IC2.31 R11.1
SWCLK  (via drill 0.3)
  Top 0.305: IC2.45 9.65,15.77 9.14,15.77 8.96,15.77 v8.43,15.24
  Bottom 0.254: CN2.4 8.53,9.98 8.53,13.72 8.79,13.97 8.79,14.88 v8.43,15.24
SWDIO  (via drill 0.3)
  Top 0.305: IC2.46 9.73,15.27 8.84,14.38 v8.03,14.38
  Bottom 0.254: CN2.2 8.03,9.21 v8.03,14.38
TX
  Top 0.61: R4.1 44.48,15.06 | 44.48,15.06 41.88,15.06 41.2,15.75 41.2,17.53 41.66,17.98 U2.11 | J9.2 45.09,13.99 45.09,14.45 | 45.09,14.45 44.48,15.06 | 45.09,14.45 45.09,14.55 45.59,15.06
VBAT  (1 unrouted)
  Top 0.305: 6.46,30.72 6.48,30.73 | J6.1 6.48,30.73 | 5.84,32.51 5.84,32.26 5.97,32.13 | 5.97,32.13 6.6,31.5 7.11,31.5 7.24,31.37 7.24,29.97 5.33,29.97 4.95,30.35 4.95,31.11 5.97,32.13 | 5.97,32.13 5.97,31.62 6.48,31.11 | 6.48,31.11 6.48,31.37 | 6.48,31.37 6.1,31.75 | 6.48,31.37 6.6,31.24 6.99,31.24 7.11,31.11 7.11,30.23 6.86,30.23 6.73,30.1 | 6.48,30.73 6.48,31.11
  Top 0.406: IC1.3 6.98,31.86 5.46,33.38 | 5.49,32.89 6.04,32.33 8.97,32.33 8.97,31.47 7.77,31.47 7.16,30.86 7.16,31.27 6.33,32.11 8,32.11 | 8.74,32.11 8,32.11 | 8,32.11 7.21,31.32 7.21,31.93
  Top 1.27: SW1.COM1 10.16,38.1 9.4,37.34 6.73,37.34 5.46,36.07 5.46,33.38 5.46,30.72 6.46,30.72
  Bottom 1.27: J2.11 14.89,38 14.22,37.34 11.68,37.34 SW1.COM1
VBAT_IN
  Top 0.406: SW1.CH1A 14.43,37.13 R5.2 15.47,36.05 Q2.3 18.25,35.62 R17.1
  pour Top: 19.02,34.82 15.54,34.82 12.65,37.72 11.94,38.43 11.94,39.45 13.21,39.45 14.94,37.72 15.95,37.72 15.95,36.32 16.51,35.76 19,35.76 19.02,35.76
VBUS  (1 unrouted)
  Top 0.254: 4.45,11.68 4.45,24.38 5.59,25.53 7.49,25.53 7.62,25.4 7.62,23.88 7.37,23.62 6.1,23.62 5.33,22.86 5.33,13.46 5.84,12.95 5.84,11.68 4.7,11.68 | 4.7,11.68 4.57,11.81 | 4.7,11.81 4.7,24.38 5.71,25.4 7.37,25.4 7.49,25.27 7.49,24 7.24,23.75 5.46,23.75 4.83,23.11 | 4.83,23.11 4.83,12.19 | 4.83,12.19 4.83,11.94 5.59,11.94 5.59,12.95 5.33,13.21 5.33,12.19 5.46,12.06 4.95,12.06 4.83,12.19 | 4.83,23.11 4.83,24.26 5.84,25.27 7.24,25.27 7.37,25.15 7.37,24.13 7.11,23.88 5.33,23.88 4.95,23.5 4.95,24.13 5.97,25.15 7.11,25.15 7.24,25.02 7.24,24.26 6.99,24 5.21,24 5.08,23.88 5.08,24 6.1,25.02 6.99,25.02 7.11,24.89 7.11,24.38 6.86,24.13 5.46,24.13 6.22,24.89 6.35,24.89 6.86,24.89 6.86,24.38 6.73,24.26 5.84,24.26 6.35,24.77 6.6,24.77 6.73,24.64 6.73,24.51 6.6,24.38 6.48,24.38 | 6.48,24.38 6.22,24.38 6.48,24.64 6.6,24.51 | J1.1 6.48,24.38 | 4.7,11.68 4.73,11.71 J5.1
  Top 0.406: J5.1 5.08,22.97 J1.1 | IC1.4 8.9,27.52 C9.2 8.91,27.46 6.35,24.89 | 5.13,24.92 5.13,24.97 8.28,28.12 8.28,29.67 9.17,29.67 9.17,27.13 7.16,25.12 7.16,25.48 8.69,27 8.69,29.46 8.59,29.46 8.59,27.66 6.5,25.58 6.2,25.58 8.53,27.91
  Top 0.813: CHG.+ 9.09,34.75 SW1.COM2
  pour Bottom: 5.56,23.67 8.08,23.67 10.92,26.52 10.92,36.02 10.39,36.55 9.73,36.55 9.12,35.94 9.12,26.85 7.77,25.5 5.77,25.5 5.56,25.5
VDDCORE
  Top 0.305: IC2.43 8.84,16.77 C7.1
VIN
  Top 0.254: U1.3 18.2,28.01 | 18.2,28.01 D3.C | 18.2,28.01 18.19,28.01 18.19,29.74 18.35,29.91 U1.1 C16.2 C10.2 20.07,33.43 | 20.07,33.43 C17.2 | Q2.2 18.57,33.52 | 18.57,33.52 19.97,33.52 20.07,33.43 | R17.2 18.47,33.62 18.57,33.52
  pour Top: 16.38,34.26 18.95,34.26 19.53,34.85 20.6,34.85 20.6,29.67 19.2,29.67 19,29.46 19,28.47 19.2,28.27 20.68,28.27 20.68,27.46 19.58,27.46 19,26.87 17.17,26.87 16.76,26.87 16.76,29.87 17.09,30.2 19.05,30.2 19.56,30.71 19.56,32.77 19.28,33.05 16.38,33.05
VSYS
  Top 0.406: SW1.CH2A 12.7,35.77 Q2.1 15.47,33 R15.1 15.47,31.5 15.66,31.69 D3.A
  pour Top: 11.86,36.65 13,36.65 15.72,33.93 15.82,33.83 15.82,33.12 15.82,32.94 16.23,32.54 18.92,32.54 18.92,30.86 16.71,30.86 15.98,30.12 14.91,30.12 14.91,32.46 11.81,35.56 11.81,36.65 11.84,36.65

### Text on the board
tPlace: VBAT | GND | 3V3 | D9 | D8 | D7 | D6 | D5 | D4 | D3 | D2 | OFF | ON | VBAT | + | - | + | - | CHG | 915MHz | IO2 | 3V3 | 3V3 | GND | TX | RX | 868MHz | SDA | SCL | 3V3 | GND | 433MHz | SWD | RST | D13 | D12 | D11 | D10 | A0 | A1 | A2 | A3 | A4 | A5
bPlace: OFF | ON | Maduino Zero | Lorawan Node v2.0 | www.makerfabs.com